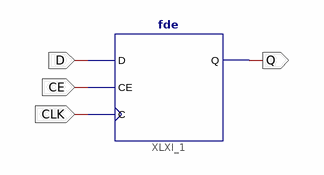
[diagram p0: schematic sheet 1]
// Xilinx ISE schematic my_status_register.sch (virtex6) as structural Verilog: 1 symbols, 4 ports
module my_status_register (
  input  D,
  input  CE,
  input  CLK,
  output Q
);

  fde XLXI_1 (.C(CLK), .CE(CE), .D(D), .Q(Q));
endmodule
